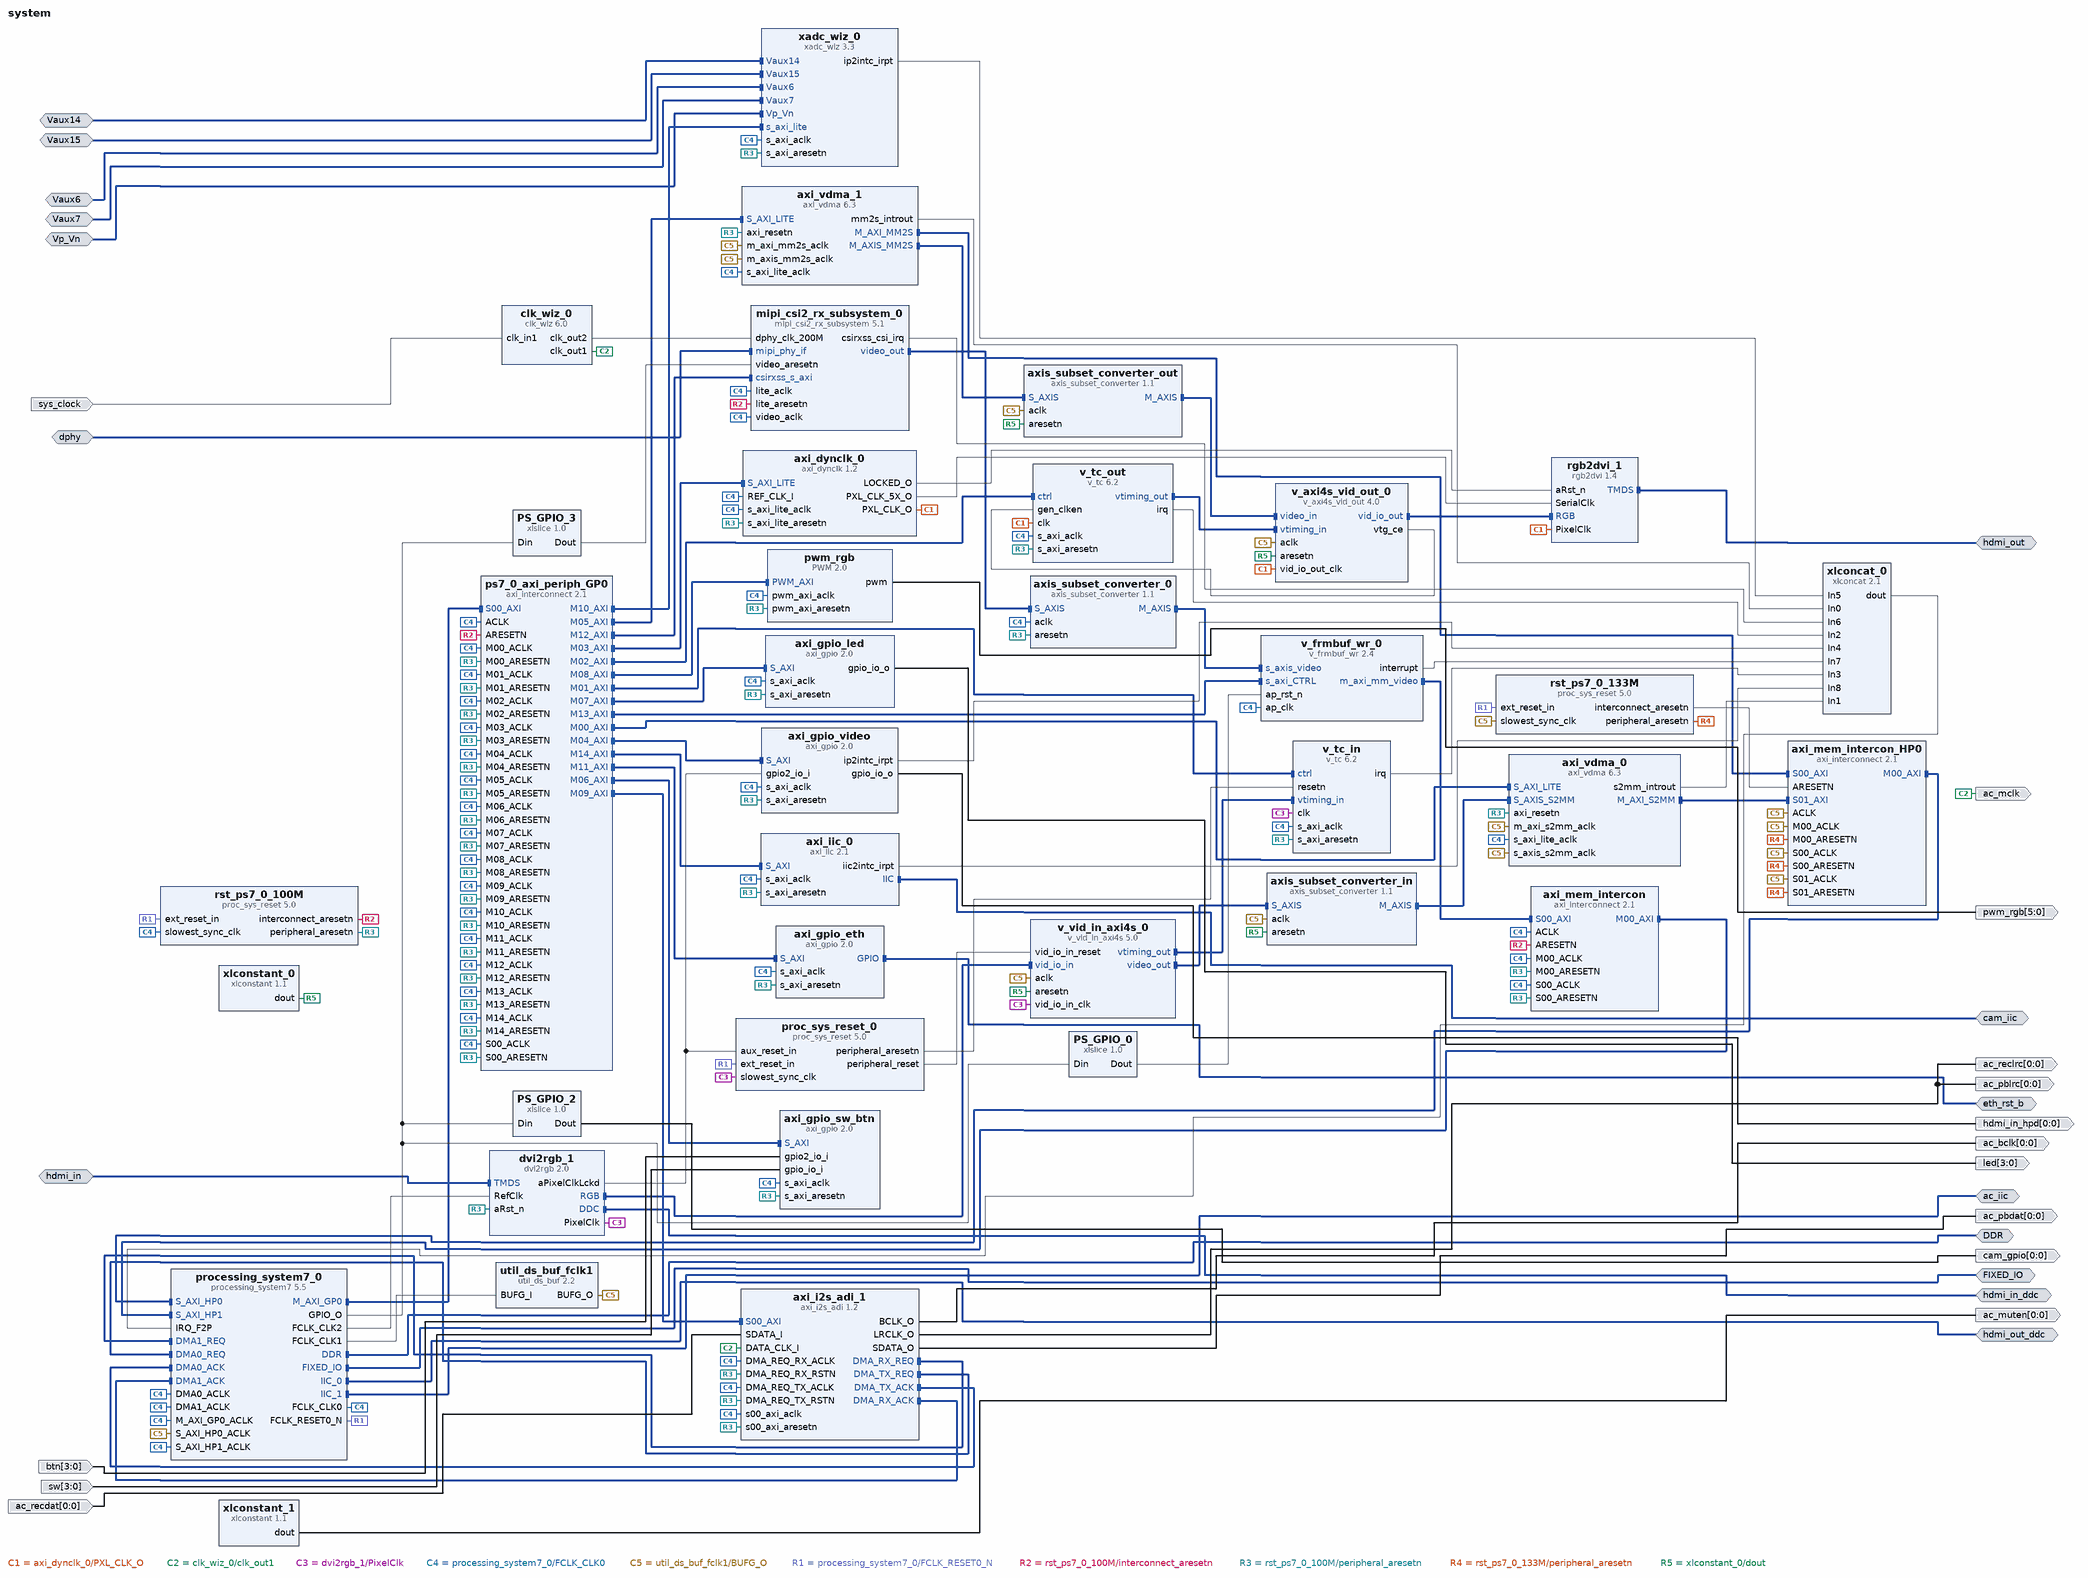
[diagram p0: block diagram of the top level]
# Vivado block design system, xc7z020clg400-1, Vivado 2022.1
create_bd_design system

create_bd_intf_port -mode Master -vlnv xilinx.com:interface:ddrx_rtl:1.0 DDR
create_bd_intf_port -mode Master -vlnv xilinx.com:display_processing_system7:fixedio_rtl:1.0 FIXED_IO
create_bd_intf_port -mode Slave -vlnv xilinx.com:interface:diff_analog_io_rtl:1.0 Vaux6
create_bd_intf_port -mode Slave -vlnv xilinx.com:interface:diff_analog_io_rtl:1.0 Vaux7
create_bd_intf_port -mode Slave -vlnv xilinx.com:interface:diff_analog_io_rtl:1.0 Vaux14
create_bd_intf_port -mode Slave -vlnv xilinx.com:interface:diff_analog_io_rtl:1.0 Vaux15
create_bd_intf_port -mode Slave -vlnv xilinx.com:interface:diff_analog_io_rtl:1.0 Vp_Vn
create_bd_intf_port -mode Master -vlnv xilinx.com:interface:iic_rtl:1.0 ac_iic
create_bd_intf_port -mode Master -vlnv xilinx.com:interface:iic_rtl:1.0 cam_iic
create_bd_intf_port -mode Slave -vlnv xilinx.com:interface:mipi_phy_rtl:1.0 dphy
create_bd_intf_port -mode Master -vlnv xilinx.com:interface:gpio_rtl:1.0 eth_rst_b
create_bd_intf_port -mode Slave -vlnv digilentinc.com:interface:tmds_rtl:1.0 hdmi_in
create_bd_intf_port -mode Master -vlnv xilinx.com:interface:iic_rtl:1.0 hdmi_in_ddc
create_bd_intf_port -mode Master -vlnv digilentinc.com:interface:tmds_rtl:1.0 hdmi_out
create_bd_intf_port -mode Master -vlnv xilinx.com:interface:iic_rtl:1.0 hdmi_out_ddc
create_bd_port -dir O -from 0 -to 0 ac_bclk
create_bd_port -dir O -type clk ac_mclk
create_bd_port -dir O -from 0 -to 0 ac_muten
create_bd_port -dir O -from 0 -to 0 ac_pbdat
create_bd_port -dir O -from 0 -to 0 ac_pblrc
create_bd_port -dir I -from 0 -to 0 ac_recdat
create_bd_port -dir O -from 0 -to 0 ac_reclrc
create_bd_port -dir O -from 0 -to 0 cam_gpio
create_bd_port -dir O -from 0 -to 0 hdmi_in_hpd
create_bd_port -dir O -from 5 -to 0 pwm_rgb
create_bd_port -dir I -type clk sys_clock
set_property -dict {CONFIG.FREQ_HZ 125000000 CONFIG.PHASE 0.000} [get_bd_ports sys_clock]
create_bd_port -dir I -from 3 -to 0 sw
create_bd_port -dir I -from 3 -to 0 btn
create_bd_port -dir O -from 3 -to 0 led

create_bd_cell -type ip -vlnv xilinx.com:ip:xlslice:1.0 PS_GPIO_0
set_property -dict {CONFIG.DIN_FROM 0 CONFIG.DIN_TO 0 CONFIG.DIN_WIDTH 64} [get_bd_cells PS_GPIO_0]
create_bd_cell -type ip -vlnv xilinx.com:ip:xlslice:1.0 PS_GPIO_2
set_property -dict {CONFIG.DIN_FROM 2 CONFIG.DIN_TO 2 CONFIG.DIN_WIDTH 64 CONFIG.DOUT_WIDTH 1} [get_bd_cells PS_GPIO_2]
create_bd_cell -type ip -vlnv xilinx.com:ip:xlslice:1.0 PS_GPIO_3
set_property -dict {CONFIG.DIN_FROM 3 CONFIG.DIN_TO 3 CONFIG.DIN_WIDTH 64 CONFIG.DOUT_WIDTH 1} [get_bd_cells PS_GPIO_3]
create_bd_cell -type ip -vlnv digilentinc.com:ip:axi_dynclk:1.2 axi_dynclk_0
create_bd_cell -type ip -vlnv xilinx.com:ip:axi_gpio:2.0 axi_gpio_eth
set_property -dict [list \
  CONFIG.C_DOUT_DEFAULT 0x00000000 \
  CONFIG.C_GPIO_WIDTH 1 \
  CONFIG.C_TRI_DEFAULT 0xFFFFFFFF \
] [get_bd_cells axi_gpio_eth]
create_bd_cell -type ip -vlnv xilinx.com:ip:axi_gpio:2.0 axi_gpio_led
set_property -dict [list \
  CONFIG.C_ALL_OUTPUTS 1 \
  CONFIG.C_DOUT_DEFAULT 0x00000000 \
  CONFIG.C_GPIO_WIDTH 4 \
  CONFIG.USE_BOARD_FLOW true \
] [get_bd_cells axi_gpio_led]
create_bd_cell -type ip -vlnv xilinx.com:ip:axi_gpio:2.0 axi_gpio_sw_btn
set_property -dict [list \
  CONFIG.C_ALL_INPUTS 1 \
  CONFIG.C_ALL_INPUTS_2 1 \
  CONFIG.C_GPIO2_WIDTH 4 \
  CONFIG.C_GPIO_WIDTH 4 \
  CONFIG.C_IS_DUAL 1 \
  CONFIG.USE_BOARD_FLOW true \
] [get_bd_cells axi_gpio_sw_btn]
create_bd_cell -type ip -vlnv xilinx.com:ip:axi_gpio:2.0 axi_gpio_video
set_property -dict [list \
  CONFIG.C_ALL_INPUTS_2 1 \
  CONFIG.C_ALL_OUTPUTS 1 \
  CONFIG.C_GPIO2_WIDTH 1 \
  CONFIG.C_GPIO_WIDTH 1 \
  CONFIG.C_INTERRUPT_PRESENT 1 \
  CONFIG.C_IS_DUAL 1 \
] [get_bd_cells axi_gpio_video]
create_bd_cell -type ip -vlnv digilentinc.com:user:axi_i2s_adi:1.2 axi_i2s_adi_1
set_property -dict {CONFIG.C_DMA_TYPE 1} [get_bd_cells axi_i2s_adi_1]
create_bd_cell -type ip -vlnv xilinx.com:ip:axi_iic:2.1 axi_iic_0
set_property -dict {CONFIG.IIC_FREQ_KHZ 400} [get_bd_cells axi_iic_0]
create_bd_cell -type ip -vlnv xilinx.com:ip:axi_interconnect:2.1 axi_mem_intercon
set_property -dict {CONFIG.NUM_MI 1 CONFIG.S00_HAS_DATA_FIFO 0 CONFIG.S00_HAS_REGSLICE 0} [get_bd_cells axi_mem_intercon]
create_bd_cell -type ip -vlnv xilinx.com:ip:axi_interconnect:2.1 axi_mem_intercon_HP0
set_property -dict [list \
  CONFIG.ENABLE_ADVANCED_OPTIONS 1 \
  CONFIG.M00_HAS_REGSLICE 4 \
  CONFIG.NUM_MI 1 \
  CONFIG.NUM_SI 2 \
  CONFIG.S00_HAS_REGSLICE 4 \
  CONFIG.S01_HAS_REGSLICE 4 \
  CONFIG.SYNCHRONIZATION_STAGES 2 \
  CONFIG.XBAR_DATA_WIDTH 64 \
] [get_bd_cells axi_mem_intercon_HP0]
create_bd_cell -type ip -vlnv xilinx.com:ip:axi_vdma:6.3 axi_vdma_0
set_property -dict [list \
  CONFIG.c_include_mm2s 0 \
  CONFIG.c_include_s2mm_dre 1 \
  CONFIG.c_m_axi_s2mm_data_width 64 \
  CONFIG.c_num_fstores 1 \
  CONFIG.c_s2mm_linebuffer_depth 2048 \
  CONFIG.c_s2mm_max_burst_length 32 \
] [get_bd_cells axi_vdma_0]
create_bd_cell -type ip -vlnv xilinx.com:ip:axi_vdma:6.3 axi_vdma_1
set_property -dict [list \
  CONFIG.c_include_mm2s_dre 1 \
  CONFIG.c_include_s2mm 0 \
  CONFIG.c_m_axis_mm2s_tdata_width 32 \
  CONFIG.c_mm2s_linebuffer_depth 2048 \
  CONFIG.c_mm2s_max_burst_length 32 \
  CONFIG.c_num_fstores 1 \
] [get_bd_cells axi_vdma_1]
create_bd_cell -type ip -vlnv xilinx.com:ip:axis_subset_converter:1.1 axis_subset_converter_0
create_bd_cell -type ip -vlnv xilinx.com:ip:axis_subset_converter:1.1 axis_subset_converter_in
set_property -dict [list \
  CONFIG.M_HAS_TLAST 1 \
  CONFIG.M_TDATA_NUM_BYTES 3 \
  CONFIG.M_TUSER_WIDTH 1 \
  CONFIG.S_HAS_TLAST 1 \
  CONFIG.S_TDATA_NUM_BYTES 3 \
  CONFIG.S_TUSER_WIDTH 1 \
  CONFIG.TDATA_REMAP {tdata[23:16],tdata[7:0],tdata[15:8]} \
  CONFIG.TLAST_REMAP {tlast[0]} \
  CONFIG.TUSER_REMAP {tuser[0:0]} \
] [get_bd_cells axis_subset_converter_in]
create_bd_cell -type ip -vlnv xilinx.com:ip:axis_subset_converter:1.1 axis_subset_converter_out
create_bd_cell -type ip -vlnv xilinx.com:ip:clk_wiz:6.0 clk_wiz_0
set_property -dict [list \
  CONFIG.CLKIN1_JITTER_PS 80.0 \
  CONFIG.CLKOUT1_DRIVES BUFG \
  CONFIG.CLKOUT1_JITTER 251.068 \
  CONFIG.CLKOUT1_PHASE_ERROR 222.305 \
  CONFIG.CLKOUT1_REQUESTED_OUT_FREQ 12.000 \
  CONFIG.CLKOUT2_DRIVES BUFG \
  CONFIG.CLKOUT2_JITTER 161.296 \
  CONFIG.CLKOUT2_PHASE_ERROR 222.305 \
  CONFIG.CLKOUT2_REQUESTED_OUT_FREQ 200 \
  CONFIG.CLKOUT2_USED true \
  CONFIG.CLKOUT3_DRIVES BUFG \
  CONFIG.CLKOUT4_DRIVES BUFG \
  CONFIG.CLKOUT5_DRIVES BUFG \
  CONFIG.CLKOUT6_DRIVES BUFG \
  CONFIG.CLKOUT7_DRIVES BUFG \
  CONFIG.CLK_IN1_BOARD_INTERFACE sys_clock \
  CONFIG.MMCM_CLKFBOUT_MULT_F 48 \
  CONFIG.MMCM_CLKIN1_PERIOD 8.000 \
  CONFIG.MMCM_CLKIN2_PERIOD 10.000 \
  CONFIG.MMCM_CLKOUT0_DIVIDE_F 100 \
  CONFIG.MMCM_CLKOUT1_DIVIDE 6 \
  CONFIG.MMCM_COMPENSATION ZHOLD \
  CONFIG.MMCM_DIVCLK_DIVIDE 5 \
  CONFIG.NUM_OUT_CLKS 2 \
  CONFIG.PLL_CLKIN_PERIOD 8.000 \
  CONFIG.PRIMITIVE PLL \
  CONFIG.USE_BOARD_FLOW true \
  CONFIG.USE_LOCKED false \
  CONFIG.USE_RESET false \
] [get_bd_cells clk_wiz_0]
create_bd_cell -type ip -vlnv digilentinc.com:ip:dvi2rgb:2.0 dvi2rgb_1
set_property -dict [list \
  CONFIG.IIC_BOARD_INTERFACE hdmi_in_ddc \
  CONFIG.TMDS_BOARD_INTERFACE hdmi_in \
  CONFIG.kAddBUFG true \
  CONFIG.kClkRange 2 \
  CONFIG.kDebug false \
  CONFIG.kEdidFileName dgl_720p_cea.data \
  CONFIG.kRstActiveHigh false \
] [get_bd_cells dvi2rgb_1]
create_bd_cell -type ip -vlnv xilinx.com:ip:mipi_csi2_rx_subsystem:5.1 mipi_csi2_rx_subsystem_0
set_property -dict [list \
  CONFIG.CMN_NUM_LANES 2 \
  CONFIG.CMN_PXL_FORMAT YUV422_8bit \
  CONFIG.CMN_VC All \
  CONFIG.CSI_BUF_DEPTH 4096 \
  CONFIG.C_CAL_MODE FIXED \
  CONFIG.C_DPHY_LANES 2 \
  CONFIG.C_EXDES_BOARD ZCU102 \
  CONFIG.C_HS_LINE_RATE 800 \
  CONFIG.C_HS_SETTLE_NS 147 \
  CONFIG.C_IDLY_TAP 2 \
  CONFIG.C_SHARE_IDLYCTRL true \
  CONFIG.DPY_EN_REG_IF true \
  CONFIG.DPY_LINE_RATE 800 \
] [get_bd_cells mipi_csi2_rx_subsystem_0]
create_bd_cell -type ip -vlnv xilinx.com:ip:proc_sys_reset:5.0 proc_sys_reset_0
create_bd_cell -type ip -vlnv xilinx.com:ip:processing_system7:5.5 processing_system7_0
set_property -dict [list \
  CONFIG.PCW_APU_PERIPHERAL_FREQMHZ 667 \
  CONFIG.PCW_ENET0_ENET0_IO {MIO 16 .. 27} \
  CONFIG.PCW_ENET0_GRP_MDIO_ENABLE 1 \
  CONFIG.PCW_ENET0_GRP_MDIO_IO {MIO 52 .. 53} \
  CONFIG.PCW_ENET0_PERIPHERAL_ENABLE 1 \
  CONFIG.PCW_ENET0_RESET_ENABLE 0 \
  CONFIG.PCW_ENET_RESET_ENABLE 1 \
  CONFIG.PCW_ENET_RESET_SELECT {Share reset pin} \
  CONFIG.PCW_EN_CLK1_PORT 1 \
  CONFIG.PCW_EN_CLK2_PORT 1 \
  CONFIG.PCW_FCLK1_PERIPHERAL_CLKSRC {ARM PLL} \
  CONFIG.PCW_FPGA0_PERIPHERAL_FREQMHZ 100 \
  CONFIG.PCW_FPGA1_PERIPHERAL_FREQMHZ 133 \
  CONFIG.PCW_FPGA2_PERIPHERAL_FREQMHZ 200 \
  CONFIG.PCW_FPGA_FCLK1_ENABLE 1 \
  CONFIG.PCW_FPGA_FCLK2_ENABLE 1 \
  CONFIG.PCW_GP0_EN_MODIFIABLE_TXN 0 \
  CONFIG.PCW_GP1_EN_MODIFIABLE_TXN 0 \
  CONFIG.PCW_GPIO_EMIO_GPIO_ENABLE 1 \
  CONFIG.PCW_GPIO_EMIO_GPIO_IO 64 \
  CONFIG.PCW_GPIO_MIO_GPIO_ENABLE 1 \
  CONFIG.PCW_GPIO_MIO_GPIO_IO MIO \
  CONFIG.PCW_I2C0_I2C0_IO EMIO \
  CONFIG.PCW_I2C0_PERIPHERAL_ENABLE 1 \
  CONFIG.PCW_I2C1_I2C1_IO EMIO \
  CONFIG.PCW_I2C1_PERIPHERAL_ENABLE 1 \
  CONFIG.PCW_I2C_PERIPHERAL_FREQMHZ 111.111115 \
  CONFIG.PCW_I2C_RESET_ENABLE 1 \
  CONFIG.PCW_I2C_RESET_SELECT {Share reset pin} \
  CONFIG.PCW_IRQ_F2P_INTR 1 \
  CONFIG.PCW_PERIPHERAL_BOARD_PRESET part0 \
  CONFIG.PCW_PRESET_BANK1_VOLTAGE {LVCMOS 1.8V} \
  CONFIG.PCW_QSPI_GRP_FBCLK_ENABLE 1 \
  CONFIG.PCW_QSPI_GRP_FBCLK_IO {MIO 8} \
  CONFIG.PCW_QSPI_GRP_SINGLE_SS_ENABLE 1 \
  CONFIG.PCW_QSPI_GRP_SINGLE_SS_IO {MIO 1 .. 6} \
  CONFIG.PCW_QSPI_PERIPHERAL_ENABLE 1 \
  CONFIG.PCW_QSPI_QSPI_IO {MIO 1 .. 6} \
  CONFIG.PCW_SD0_GRP_CD_ENABLE 1 \
  CONFIG.PCW_SD0_GRP_CD_IO {MIO 47} \
  CONFIG.PCW_SD0_GRP_WP_ENABLE 0 \
  CONFIG.PCW_SD0_PERIPHERAL_ENABLE 1 \
  CONFIG.PCW_SD0_SD0_IO {MIO 40 .. 45} \
  CONFIG.PCW_SDIO_PERIPHERAL_FREQMHZ 50 \
  CONFIG.PCW_SINGLE_QSPI_DATA_MODE x4 \
  CONFIG.PCW_TTC0_PERIPHERAL_ENABLE 1 \
  CONFIG.PCW_TTC0_TTC0_IO EMIO \
  CONFIG.PCW_UART1_PERIPHERAL_ENABLE 1 \
  CONFIG.PCW_UART1_UART1_IO {MIO 48 .. 49} \
  CONFIG.PCW_UART_PERIPHERAL_FREQMHZ 100 \
  CONFIG.PCW_UIPARAM_DDR_FREQ_MHZ 533.333333 \
  CONFIG.PCW_UIPARAM_DDR_MEMORY_TYPE {DDR 3 (Low Voltage)} \
  CONFIG.PCW_UIPARAM_DDR_PARTNO {MT41K256M16 RE-125} \
  CONFIG.PCW_USB0_PERIPHERAL_ENABLE 1 \
  CONFIG.PCW_USB0_RESET_ENABLE 1 \
  CONFIG.PCW_USB0_RESET_IO {MIO 46} \
  CONFIG.PCW_USB0_USB0_IO {MIO 28 .. 39} \
  CONFIG.PCW_USB_RESET_ENABLE 1 \
  CONFIG.PCW_USB_RESET_SELECT {Share reset pin} \
  CONFIG.PCW_USE_DMA0 1 \
  CONFIG.PCW_USE_DMA1 1 \
  CONFIG.PCW_USE_FABRIC_INTERRUPT 1 \
  CONFIG.PCW_USE_S_AXI_HP0 1 \
  CONFIG.PCW_USE_S_AXI_HP1 1 \
] [get_bd_cells processing_system7_0]
# 520 more settings of processing_system7_0 are not shown: defaults, MIO pin electricals, DDR timing, and values the tool derives
create_bd_cell -type ip -vlnv xilinx.com:ip:axi_interconnect:2.1 ps7_0_axi_periph_GP0
set_property -dict {CONFIG.NUM_MI 15 CONFIG.SYNCHRONIZATION_STAGES 2} [get_bd_cells ps7_0_axi_periph_GP0]
create_bd_cell -type ip -vlnv digilentinc.com:IP:PWM:2.0 pwm_rgb
set_property -dict {CONFIG.NUM_PWM 6} [get_bd_cells pwm_rgb]
create_bd_cell -type ip -vlnv digilentinc.com:ip:rgb2dvi:1.4 rgb2dvi_1
set_property -dict [list \
  CONFIG.TMDS_BOARD_INTERFACE hdmi_out \
  CONFIG.kGenerateSerialClk false \
  CONFIG.kRstActiveHigh false \
] [get_bd_cells rgb2dvi_1]
create_bd_cell -type ip -vlnv xilinx.com:ip:proc_sys_reset:5.0 rst_ps7_0_100M
create_bd_cell -type ip -vlnv xilinx.com:ip:proc_sys_reset:5.0 rst_ps7_0_133M
create_bd_cell -type ip -vlnv xilinx.com:ip:util_ds_buf:2.2 util_ds_buf_fclk1
set_property -dict {CONFIG.C_BUF_TYPE BUFG} [get_bd_cells util_ds_buf_fclk1]
create_bd_cell -type ip -vlnv xilinx.com:ip:v_axi4s_vid_out:4.0 v_axi4s_vid_out_0
set_property -dict {CONFIG.C_ADDR_WIDTH 12 CONFIG.C_HAS_ASYNC_CLK 1 CONFIG.C_VTG_MASTER_SLAVE 1} [get_bd_cells v_axi4s_vid_out_0]
create_bd_cell -type ip -vlnv xilinx.com:ip:v_frmbuf_wr:2.4 v_frmbuf_wr_0
set_property -dict [list \
  CONFIG.AXIMM_DATA_WIDTH 64 \
  CONFIG.C_M_AXI_MM_VIDEO_DATA_WIDTH 64 \
  CONFIG.HAS_RGB8 0 \
  CONFIG.HAS_UYVY8 1 \
  CONFIG.HAS_YUYV8 1 \
  CONFIG.HAS_Y_UV8 1 \
  CONFIG.MAX_NR_PLANES 2 \
  CONFIG.SAMPLES_PER_CLOCK 1 \
] [get_bd_cells v_frmbuf_wr_0]
create_bd_cell -type ip -vlnv xilinx.com:ip:v_tc:6.2 v_tc_in
set_property -dict [list \
  CONFIG.HAS_INTC_IF true \
  CONFIG.enable_generation false \
  CONFIG.horizontal_blank_detection false \
  CONFIG.vertical_blank_detection false \
] [get_bd_cells v_tc_in]
create_bd_cell -type ip -vlnv xilinx.com:ip:v_tc:6.2 v_tc_out
set_property -dict {CONFIG.enable_detection false} [get_bd_cells v_tc_out]
create_bd_cell -type ip -vlnv xilinx.com:ip:v_vid_in_axi4s:5.0 v_vid_in_axi4s_0
set_property -dict {CONFIG.C_ADDR_WIDTH 12 CONFIG.C_HAS_ASYNC_CLK 1} [get_bd_cells v_vid_in_axi4s_0]
create_bd_cell -type ip -vlnv xilinx.com:ip:xadc_wiz:3.3 xadc_wiz_0
set_property -dict [list \
  CONFIG.CHANNEL_AVERAGING 16 \
  CONFIG.CHANNEL_ENABLE_CALIBRATION true \
  CONFIG.CHANNEL_ENABLE_TEMPERATURE true \
  CONFIG.CHANNEL_ENABLE_VAUXP14_VAUXN14 true \
  CONFIG.CHANNEL_ENABLE_VAUXP15_VAUXN15 true \
  CONFIG.CHANNEL_ENABLE_VAUXP6_VAUXN6 true \
  CONFIG.CHANNEL_ENABLE_VAUXP7_VAUXN7 true \
  CONFIG.CHANNEL_ENABLE_VBRAM true \
  CONFIG.CHANNEL_ENABLE_VCCAUX true \
  CONFIG.CHANNEL_ENABLE_VCCDDRO true \
  CONFIG.CHANNEL_ENABLE_VCCINT true \
  CONFIG.CHANNEL_ENABLE_VCCPAUX true \
  CONFIG.CHANNEL_ENABLE_VCCPINT true \
  CONFIG.CHANNEL_ENABLE_VP_VN false \
  CONFIG.CHANNEL_ENABLE_VREFN true \
  CONFIG.CHANNEL_ENABLE_VREFP true \
  CONFIG.ENABLE_RESET false \
  CONFIG.ENABLE_VCCDDRO_ALARM false \
  CONFIG.ENABLE_VCCPAUX_ALARM false \
  CONFIG.ENABLE_VCCPINT_ALARM false \
  CONFIG.EXTERNAL_MUX_CHANNEL VP_VN \
  CONFIG.INTERFACE_SELECTION Enable_AXI \
  CONFIG.OT_ALARM false \
  CONFIG.SEQUENCER_MODE Continuous \
  CONFIG.SINGLE_CHANNEL_SELECTION TEMPERATURE \
  CONFIG.USER_TEMP_ALARM false \
  CONFIG.VCCAUX_ALARM false \
  CONFIG.VCCINT_ALARM false \
  CONFIG.XADC_STARUP_SELECTION channel_sequencer \
] [get_bd_cells xadc_wiz_0]
create_bd_cell -type ip -vlnv xilinx.com:ip:xlconcat:2.1 xlconcat_0
set_property -dict {CONFIG.NUM_PORTS 9} [get_bd_cells xlconcat_0]
create_bd_cell -type ip -vlnv xilinx.com:ip:xlconstant:1.1 xlconstant_0
create_bd_cell -type ip -vlnv xilinx.com:ip:xlconstant:1.1 xlconstant_1

# ---- connections ----

connect_bd_intf_net -intf_net Vaux14_1 [get_bd_intf_ports Vaux14] [get_bd_intf_pins xadc_wiz_0/Vaux14]
connect_bd_intf_net -intf_net Vaux15_1 [get_bd_intf_ports Vaux15] [get_bd_intf_pins xadc_wiz_0/Vaux15]
connect_bd_intf_net -intf_net Vaux6_1 [get_bd_intf_ports Vaux6] [get_bd_intf_pins xadc_wiz_0/Vaux6]
connect_bd_intf_net -intf_net Vaux7_1 [get_bd_intf_ports Vaux7] [get_bd_intf_pins xadc_wiz_0/Vaux7]
connect_bd_intf_net [get_bd_intf_ports Vp_Vn] [get_bd_intf_pins xadc_wiz_0/Vp_Vn]
connect_bd_intf_net [get_bd_intf_ports eth_rst_b] [get_bd_intf_pins axi_gpio_eth/GPIO]
connect_bd_intf_net [get_bd_intf_pins axi_i2s_adi_1/DMA_RX_REQ] [get_bd_intf_pins processing_system7_0/DMA1_REQ]
connect_bd_intf_net [get_bd_intf_pins axi_i2s_adi_1/DMA_TX_REQ] [get_bd_intf_pins processing_system7_0/DMA0_REQ]
connect_bd_intf_net [get_bd_intf_ports cam_iic] [get_bd_intf_pins axi_iic_0/IIC]
connect_bd_intf_net -intf_net axi_mem_intercon_M00_AXI [get_bd_intf_pins axi_mem_intercon_HP0/M00_AXI] [get_bd_intf_pins processing_system7_0/S_AXI_HP0]
connect_bd_intf_net [get_bd_intf_pins axi_mem_intercon/M00_AXI] [get_bd_intf_pins processing_system7_0/S_AXI_HP1]
connect_bd_intf_net [get_bd_intf_pins axi_mem_intercon_HP0/S01_AXI] [get_bd_intf_pins axi_vdma_0/M_AXI_S2MM]
connect_bd_intf_net [get_bd_intf_pins axi_vdma_1/M_AXIS_MM2S] [get_bd_intf_pins axis_subset_converter_out/S_AXIS]
connect_bd_intf_net [get_bd_intf_pins axi_mem_intercon_HP0/S00_AXI] [get_bd_intf_pins axi_vdma_1/M_AXI_MM2S]
connect_bd_intf_net [get_bd_intf_pins axis_subset_converter_0/M_AXIS] [get_bd_intf_pins v_frmbuf_wr_0/s_axis_video]
connect_bd_intf_net [get_bd_intf_pins axi_vdma_0/S_AXIS_S2MM] [get_bd_intf_pins axis_subset_converter_in/M_AXIS]
connect_bd_intf_net [get_bd_intf_pins axis_subset_converter_out/M_AXIS] [get_bd_intf_pins v_axi4s_vid_out_0/video_in]
connect_bd_intf_net [get_bd_intf_ports dphy] [get_bd_intf_pins mipi_csi2_rx_subsystem_0/mipi_phy_if]
connect_bd_intf_net [get_bd_intf_ports hdmi_in_ddc] [get_bd_intf_pins dvi2rgb_1/DDC]
connect_bd_intf_net [get_bd_intf_pins dvi2rgb_1/RGB] [get_bd_intf_pins v_vid_in_axi4s_0/vid_io_in]
connect_bd_intf_net [get_bd_intf_ports hdmi_in] [get_bd_intf_pins dvi2rgb_1/TMDS]
connect_bd_intf_net [get_bd_intf_pins axis_subset_converter_0/S_AXIS] [get_bd_intf_pins mipi_csi2_rx_subsystem_0/video_out]
connect_bd_intf_net [get_bd_intf_ports DDR] [get_bd_intf_pins processing_system7_0/DDR]
connect_bd_intf_net [get_bd_intf_pins axi_i2s_adi_1/DMA_TX_ACK] [get_bd_intf_pins processing_system7_0/DMA0_ACK]
connect_bd_intf_net [get_bd_intf_pins axi_i2s_adi_1/DMA_RX_ACK] [get_bd_intf_pins processing_system7_0/DMA1_ACK]
connect_bd_intf_net [get_bd_intf_ports FIXED_IO] [get_bd_intf_pins processing_system7_0/FIXED_IO]
connect_bd_intf_net [get_bd_intf_ports hdmi_out_ddc] [get_bd_intf_pins processing_system7_0/IIC_0]
connect_bd_intf_net [get_bd_intf_ports ac_iic] [get_bd_intf_pins processing_system7_0/IIC_1]
connect_bd_intf_net [get_bd_intf_pins processing_system7_0/M_AXI_GP0] [get_bd_intf_pins ps7_0_axi_periph_GP0/S00_AXI]
connect_bd_intf_net [get_bd_intf_pins axi_gpio_video/S_AXI] [get_bd_intf_pins ps7_0_axi_periph_GP0/M04_AXI]
connect_bd_intf_net [get_bd_intf_pins axi_vdma_1/S_AXI_LITE] [get_bd_intf_pins ps7_0_axi_periph_GP0/M05_AXI]
connect_bd_intf_net [get_bd_intf_pins axi_gpio_sw_btn/S_AXI] [get_bd_intf_pins ps7_0_axi_periph_GP0/M06_AXI]
connect_bd_intf_net [get_bd_intf_pins axi_gpio_led/S_AXI] [get_bd_intf_pins ps7_0_axi_periph_GP0/M07_AXI]
connect_bd_intf_net [get_bd_intf_pins ps7_0_axi_periph_GP0/M08_AXI] [get_bd_intf_pins pwm_rgb/PWM_AXI]
connect_bd_intf_net [get_bd_intf_pins axi_i2s_adi_1/S00_AXI] [get_bd_intf_pins ps7_0_axi_periph_GP0/M09_AXI]
connect_bd_intf_net [get_bd_intf_pins ps7_0_axi_periph_GP0/M10_AXI] [get_bd_intf_pins xadc_wiz_0/s_axi_lite]
connect_bd_intf_net [get_bd_intf_pins axi_gpio_eth/S_AXI] [get_bd_intf_pins ps7_0_axi_periph_GP0/M11_AXI]
connect_bd_intf_net [get_bd_intf_pins mipi_csi2_rx_subsystem_0/csirxss_s_axi] [get_bd_intf_pins ps7_0_axi_periph_GP0/M12_AXI]
connect_bd_intf_net [get_bd_intf_pins ps7_0_axi_periph_GP0/M13_AXI] [get_bd_intf_pins v_frmbuf_wr_0/s_axi_CTRL]
connect_bd_intf_net [get_bd_intf_pins axi_iic_0/S_AXI] [get_bd_intf_pins ps7_0_axi_periph_GP0/M14_AXI]
connect_bd_intf_net [get_bd_intf_pins axi_vdma_0/S_AXI_LITE] [get_bd_intf_pins ps7_0_axi_periph_GP0/M00_AXI]
connect_bd_intf_net [get_bd_intf_pins ps7_0_axi_periph_GP0/M01_AXI] [get_bd_intf_pins v_tc_in/ctrl]
connect_bd_intf_net [get_bd_intf_pins ps7_0_axi_periph_GP0/M02_AXI] [get_bd_intf_pins v_tc_out/ctrl]
connect_bd_intf_net [get_bd_intf_pins axi_dynclk_0/S_AXI_LITE] [get_bd_intf_pins ps7_0_axi_periph_GP0/M03_AXI]
connect_bd_intf_net [get_bd_intf_ports hdmi_out] [get_bd_intf_pins rgb2dvi_1/TMDS]
connect_bd_intf_net [get_bd_intf_pins rgb2dvi_1/RGB] [get_bd_intf_pins v_axi4s_vid_out_0/vid_io_out]
connect_bd_intf_net [get_bd_intf_pins axi_mem_intercon/S00_AXI] [get_bd_intf_pins v_frmbuf_wr_0/m_axi_mm_video]
connect_bd_intf_net -intf_net v_tc_1_vtiming_out [get_bd_intf_pins v_axi4s_vid_out_0/vtiming_in] [get_bd_intf_pins v_tc_out/vtiming_out]
connect_bd_intf_net [get_bd_intf_pins axis_subset_converter_in/S_AXIS] [get_bd_intf_pins v_vid_in_axi4s_0/video_out]
connect_bd_intf_net [get_bd_intf_pins v_tc_in/vtiming_in] [get_bd_intf_pins v_vid_in_axi4s_0/vtiming_out]
connect_bd_net [get_bd_pins PS_GPIO_0/Dout] [get_bd_pins v_frmbuf_wr_0/ap_rst_n]
connect_bd_net -net PWM_0_pwm [get_bd_pins pwm_rgb/pwm] [get_bd_ports pwm_rgb]
connect_bd_net -net SDATA_I_1 [get_bd_ports ac_recdat] [get_bd_pins axi_i2s_adi_1/SDATA_I]
connect_bd_net [get_bd_pins axi_dynclk_0/LOCKED_O] [get_bd_pins rgb2dvi_1/aRst_n]
connect_bd_net [get_bd_pins axi_dynclk_0/PXL_CLK_5X_O] [get_bd_pins rgb2dvi_1/SerialClk]
connect_bd_net [get_bd_pins axi_dynclk_0/PXL_CLK_O] \
  [get_bd_pins rgb2dvi_1/PixelClk] [get_bd_pins v_axi4s_vid_out_0/vid_io_out_clk] [get_bd_pins v_tc_out/clk]
connect_bd_net -net axi_gpio_0_gpio_io_o [get_bd_pins axi_gpio_video/gpio_io_o] [get_bd_ports hdmi_in_hpd]
connect_bd_net -net axi_gpio_0_ip2intc_irpt [get_bd_pins axi_gpio_video/ip2intc_irpt] [get_bd_pins xlconcat_0/In4]
connect_bd_net [get_bd_pins axi_gpio_led/gpio_io_o] [get_bd_ports led]
connect_bd_net [get_bd_pins axi_i2s_adi_1/BCLK_O] [get_bd_ports ac_bclk]
connect_bd_net [get_bd_pins axi_i2s_adi_1/LRCLK_O] [get_bd_ports ac_pblrc] [get_bd_ports ac_reclrc]
connect_bd_net [get_bd_pins axi_i2s_adi_1/SDATA_O] [get_bd_ports ac_pbdat]
connect_bd_net [get_bd_pins axi_iic_0/iic2intc_irpt] [get_bd_pins xlconcat_0/In8]
connect_bd_net [get_bd_pins axi_vdma_0/s2mm_introut] [get_bd_pins xlconcat_0/In1]
connect_bd_net [get_bd_pins axi_vdma_1/mm2s_introut] [get_bd_pins xlconcat_0/In0]
connect_bd_net [get_bd_ports btn] [get_bd_pins axi_gpio_sw_btn/gpio2_io_i]
connect_bd_net [get_bd_pins clk_wiz_0/clk_out1] [get_bd_ports ac_mclk] [get_bd_pins axi_i2s_adi_1/DATA_CLK_I]
connect_bd_net [get_bd_pins clk_wiz_0/clk_out2] [get_bd_pins mipi_csi2_rx_subsystem_0/dphy_clk_200M]
connect_bd_net -net csi2_rst_gpio [get_bd_pins PS_GPIO_3/Dout] [get_bd_pins mipi_csi2_rx_subsystem_0/video_aresetn]
connect_bd_net [get_bd_pins dvi2rgb_1/PixelClk] \
  [get_bd_pins proc_sys_reset_0/slowest_sync_clk] [get_bd_pins v_tc_in/clk] [get_bd_pins v_vid_in_axi4s_0/vid_io_in_clk]
connect_bd_net [get_bd_pins dvi2rgb_1/aPixelClkLckd] [get_bd_pins axi_gpio_video/gpio2_io_i] [get_bd_pins proc_sys_reset_0/aux_reset_in]
connect_bd_net [get_bd_pins mipi_csi2_rx_subsystem_0/csirxss_csi_irq] [get_bd_pins xlconcat_0/In6]
connect_bd_net [get_bd_pins proc_sys_reset_0/peripheral_aresetn] [get_bd_pins v_tc_in/resetn]
connect_bd_net [get_bd_pins proc_sys_reset_0/peripheral_reset] [get_bd_pins v_vid_in_axi4s_0/vid_io_in_reset]
connect_bd_net [get_bd_pins processing_system7_0/FCLK_CLK0] \
  [get_bd_pins axi_dynclk_0/REF_CLK_I] [get_bd_pins axi_dynclk_0/s_axi_lite_aclk] [get_bd_pins axi_gpio_eth/s_axi_aclk] \
  [get_bd_pins axi_gpio_led/s_axi_aclk] [get_bd_pins axi_gpio_sw_btn/s_axi_aclk] [get_bd_pins axi_gpio_video/s_axi_aclk] \
  [get_bd_pins axi_i2s_adi_1/DMA_REQ_RX_ACLK] [get_bd_pins axi_i2s_adi_1/DMA_REQ_TX_ACLK] \
  [get_bd_pins axi_i2s_adi_1/s00_axi_aclk] [get_bd_pins axi_iic_0/s_axi_aclk] [get_bd_pins axi_mem_intercon/ACLK] \
  [get_bd_pins axi_mem_intercon/M00_ACLK] [get_bd_pins axi_mem_intercon/S00_ACLK] [get_bd_pins axi_vdma_0/s_axi_lite_aclk] \
  [get_bd_pins axi_vdma_1/s_axi_lite_aclk] [get_bd_pins axis_subset_converter_0/aclk] \
  [get_bd_pins mipi_csi2_rx_subsystem_0/lite_aclk] [get_bd_pins mipi_csi2_rx_subsystem_0/video_aclk] \
  [get_bd_pins processing_system7_0/DMA0_ACLK] [get_bd_pins processing_system7_0/DMA1_ACLK] \
  [get_bd_pins processing_system7_0/M_AXI_GP0_ACLK] [get_bd_pins processing_system7_0/S_AXI_HP1_ACLK] \
  [get_bd_pins ps7_0_axi_periph_GP0/ACLK] [get_bd_pins ps7_0_axi_periph_GP0/M00_ACLK] \
  [get_bd_pins ps7_0_axi_periph_GP0/M01_ACLK] [get_bd_pins ps7_0_axi_periph_GP0/M02_ACLK] \
  [get_bd_pins ps7_0_axi_periph_GP0/M03_ACLK] [get_bd_pins ps7_0_axi_periph_GP0/M04_ACLK] \
  [get_bd_pins ps7_0_axi_periph_GP0/M05_ACLK] [get_bd_pins ps7_0_axi_periph_GP0/M06_ACLK] \
  [get_bd_pins ps7_0_axi_periph_GP0/M07_ACLK] [get_bd_pins ps7_0_axi_periph_GP0/M08_ACLK] \
  [get_bd_pins ps7_0_axi_periph_GP0/M09_ACLK] [get_bd_pins ps7_0_axi_periph_GP0/M10_ACLK] \
  [get_bd_pins ps7_0_axi_periph_GP0/M11_ACLK] [get_bd_pins ps7_0_axi_periph_GP0/M12_ACLK] \
  [get_bd_pins ps7_0_axi_periph_GP0/M13_ACLK] [get_bd_pins ps7_0_axi_periph_GP0/M14_ACLK] \
  [get_bd_pins ps7_0_axi_periph_GP0/S00_ACLK] [get_bd_pins pwm_rgb/pwm_axi_aclk] \
  [get_bd_pins rst_ps7_0_100M/slowest_sync_clk] [get_bd_pins v_frmbuf_wr_0/ap_clk] [get_bd_pins v_tc_in/s_axi_aclk] \
  [get_bd_pins v_tc_out/s_axi_aclk] [get_bd_pins xadc_wiz_0/s_axi_aclk]
connect_bd_net -net processing_system7_0_FCLK_CLK1 [get_bd_pins util_ds_buf_fclk1/BUFG_O] \
  [get_bd_pins axi_mem_intercon_HP0/ACLK] [get_bd_pins axi_mem_intercon_HP0/M00_ACLK] \
  [get_bd_pins axi_mem_intercon_HP0/S00_ACLK] [get_bd_pins axi_mem_intercon_HP0/S01_ACLK] \
  [get_bd_pins axi_vdma_0/m_axi_s2mm_aclk] [get_bd_pins axi_vdma_0/s_axis_s2mm_aclk] [get_bd_pins axi_vdma_1/m_axi_mm2s_aclk] \
  [get_bd_pins axi_vdma_1/m_axis_mm2s_aclk] [get_bd_pins axis_subset_converter_in/aclk] \
  [get_bd_pins axis_subset_converter_out/aclk] [get_bd_pins processing_system7_0/S_AXI_HP0_ACLK] \
  [get_bd_pins rst_ps7_0_133M/slowest_sync_clk] [get_bd_pins v_axi4s_vid_out_0/aclk] [get_bd_pins v_vid_in_axi4s_0/aclk]
connect_bd_net [get_bd_pins processing_system7_0/FCLK_CLK2] [get_bd_pins dvi2rgb_1/RefClk]
connect_bd_net [get_bd_pins processing_system7_0/FCLK_CLK1] [get_bd_pins util_ds_buf_fclk1/BUFG_I]
connect_bd_net [get_bd_pins processing_system7_0/FCLK_RESET0_N] \
  [get_bd_pins proc_sys_reset_0/ext_reset_in] [get_bd_pins rst_ps7_0_100M/ext_reset_in] \
  [get_bd_pins rst_ps7_0_133M/ext_reset_in]
connect_bd_net [get_bd_pins processing_system7_0/GPIO_O] [get_bd_pins PS_GPIO_0/Din] [get_bd_pins PS_GPIO_2/Din] [get_bd_pins PS_GPIO_3/Din]
connect_bd_net [get_bd_pins rst_ps7_0_100M/interconnect_aresetn] \
  [get_bd_pins axi_mem_intercon/ARESETN] [get_bd_pins mipi_csi2_rx_subsystem_0/lite_aresetn] \
  [get_bd_pins ps7_0_axi_periph_GP0/ARESETN]
connect_bd_net [get_bd_pins rst_ps7_0_100M/peripheral_aresetn] \
  [get_bd_pins axi_dynclk_0/s_axi_lite_aresetn] [get_bd_pins axi_gpio_eth/s_axi_aresetn] \
  [get_bd_pins axi_gpio_led/s_axi_aresetn] [get_bd_pins axi_gpio_sw_btn/s_axi_aresetn] \
  [get_bd_pins axi_gpio_video/s_axi_aresetn] [get_bd_pins axi_i2s_adi_1/DMA_REQ_RX_RSTN] \
  [get_bd_pins axi_i2s_adi_1/DMA_REQ_TX_RSTN] [get_bd_pins axi_i2s_adi_1/s00_axi_aresetn] \
  [get_bd_pins axi_iic_0/s_axi_aresetn] [get_bd_pins axi_mem_intercon/M00_ARESETN] [get_bd_pins axi_mem_intercon/S00_ARESETN] \
  [get_bd_pins axi_vdma_0/axi_resetn] [get_bd_pins axi_vdma_1/axi_resetn] [get_bd_pins axis_subset_converter_0/aresetn] \
  [get_bd_pins dvi2rgb_1/aRst_n] [get_bd_pins ps7_0_axi_periph_GP0/M00_ARESETN] \
  [get_bd_pins ps7_0_axi_periph_GP0/M01_ARESETN] [get_bd_pins ps7_0_axi_periph_GP0/M02_ARESETN] \
  [get_bd_pins ps7_0_axi_periph_GP0/M03_ARESETN] [get_bd_pins ps7_0_axi_periph_GP0/M04_ARESETN] \
  [get_bd_pins ps7_0_axi_periph_GP0/M05_ARESETN] [get_bd_pins ps7_0_axi_periph_GP0/M06_ARESETN] \
  [get_bd_pins ps7_0_axi_periph_GP0/M07_ARESETN] [get_bd_pins ps7_0_axi_periph_GP0/M08_ARESETN] \
  [get_bd_pins ps7_0_axi_periph_GP0/M09_ARESETN] [get_bd_pins ps7_0_axi_periph_GP0/M10_ARESETN] \
  [get_bd_pins ps7_0_axi_periph_GP0/M11_ARESETN] [get_bd_pins ps7_0_axi_periph_GP0/M12_ARESETN] \
  [get_bd_pins ps7_0_axi_periph_GP0/M13_ARESETN] [get_bd_pins ps7_0_axi_periph_GP0/M14_ARESETN] \
  [get_bd_pins ps7_0_axi_periph_GP0/S00_ARESETN] [get_bd_pins pwm_rgb/pwm_axi_aresetn] [get_bd_pins v_tc_in/s_axi_aresetn] \
  [get_bd_pins v_tc_out/s_axi_aresetn] [get_bd_pins xadc_wiz_0/s_axi_aresetn]
connect_bd_net [get_bd_pins rst_ps7_0_133M/interconnect_aresetn] [get_bd_pins axi_mem_intercon_HP0/ARESETN]
connect_bd_net [get_bd_pins rst_ps7_0_133M/peripheral_aresetn] \
  [get_bd_pins axi_mem_intercon_HP0/M00_ARESETN] [get_bd_pins axi_mem_intercon_HP0/S00_ARESETN] \
  [get_bd_pins axi_mem_intercon_HP0/S01_ARESETN]
connect_bd_net -net sensor_rst_gpio [get_bd_pins PS_GPIO_2/Dout] [get_bd_ports cam_gpio]
connect_bd_net [get_bd_ports sw] [get_bd_pins axi_gpio_sw_btn/gpio_io_i]
connect_bd_net [get_bd_ports sys_clock] [get_bd_pins clk_wiz_0/clk_in1]
connect_bd_net [get_bd_pins v_axi4s_vid_out_0/vtg_ce] [get_bd_pins v_tc_out/gen_clken]
connect_bd_net -net v_frmbuf_wr_1_interrupt [get_bd_pins v_frmbuf_wr_0/interrupt] [get_bd_pins xlconcat_0/In7]
connect_bd_net -net v_tc_1_irq [get_bd_pins v_tc_out/irq] [get_bd_pins xlconcat_0/In2]
connect_bd_net [get_bd_pins v_tc_in/irq] [get_bd_pins xlconcat_0/In3]
connect_bd_net [get_bd_pins xadc_wiz_0/ip2intc_irpt] [get_bd_pins xlconcat_0/In5]
connect_bd_net [get_bd_pins xlconcat_0/dout] [get_bd_pins processing_system7_0/IRQ_F2P]
connect_bd_net [get_bd_pins xlconstant_0/dout] \
  [get_bd_pins axis_subset_converter_in/aresetn] [get_bd_pins axis_subset_converter_out/aresetn] \
  [get_bd_pins v_axi4s_vid_out_0/aresetn] [get_bd_pins v_vid_in_axi4s_0/aresetn]
connect_bd_net [get_bd_pins xlconstant_1/dout] [get_bd_ports ac_muten]

# ---- address map ----
assign_bd_address -offset 0x00000000 -range 1G -target_address_space [get_bd_addr_spaces axi_vdma_0/Data_S2MM] [get_bd_addr_segs processing_system7_0/S_AXI_HP0/HP0_DDR_LOWOCM]
assign_bd_address -offset 0x00000000 -range 1G -target_address_space [get_bd_addr_spaces axi_vdma_1/Data_MM2S] [get_bd_addr_segs processing_system7_0/S_AXI_HP0/HP0_DDR_LOWOCM]
assign_bd_address -offset 0x41200000 -range 64K -target_address_space [get_bd_addr_spaces processing_system7_0/Data] [get_bd_addr_segs axi_gpio_video/S_AXI/Reg]
assign_bd_address -offset 0x41210000 -range 64K -target_address_space [get_bd_addr_spaces processing_system7_0/Data] [get_bd_addr_segs axi_gpio_sw_btn/S_AXI/Reg]
assign_bd_address -offset 0x41220000 -range 64K -target_address_space [get_bd_addr_spaces processing_system7_0/Data] [get_bd_addr_segs axi_gpio_led/S_AXI/Reg]
assign_bd_address -offset 0x41230000 -range 64K -target_address_space [get_bd_addr_spaces processing_system7_0/Data] [get_bd_addr_segs axi_gpio_eth/S_AXI/Reg]
assign_bd_address -offset 0x41600000 -range 64K -target_address_space [get_bd_addr_spaces processing_system7_0/Data] [get_bd_addr_segs axi_iic_0/S_AXI/Reg]
assign_bd_address -offset 0x43000000 -range 64K -target_address_space [get_bd_addr_spaces processing_system7_0/Data] [get_bd_addr_segs axi_vdma_0/S_AXI_LITE/Reg]
assign_bd_address -offset 0x43010000 -range 64K -target_address_space [get_bd_addr_spaces processing_system7_0/Data] [get_bd_addr_segs axi_vdma_1/S_AXI_LITE/Reg]
assign_bd_address -offset 0x43C00000 -range 64K -target_address_space [get_bd_addr_spaces processing_system7_0/Data] [get_bd_addr_segs v_tc_in/ctrl/Reg]
assign_bd_address -offset 0x43C10000 -range 64K -target_address_space [get_bd_addr_spaces processing_system7_0/Data] [get_bd_addr_segs v_tc_out/ctrl/Reg]
assign_bd_address -offset 0x43C20000 -range 64K -target_address_space [get_bd_addr_spaces processing_system7_0/Data] [get_bd_addr_segs axi_dynclk_0/S_AXI_LITE/S_AXI_LITE_reg]
assign_bd_address -offset 0x43C30000 -range 64K -target_address_space [get_bd_addr_spaces processing_system7_0/Data] [get_bd_addr_segs pwm_rgb/PWM_AXI/PWM_AXI_reg]
assign_bd_address -offset 0x43C40000 -range 64K -target_address_space [get_bd_addr_spaces processing_system7_0/Data] [get_bd_addr_segs axi_i2s_adi_1/S00_AXI/S00_AXI_reg]
assign_bd_address -offset 0x43C50000 -range 64K -target_address_space [get_bd_addr_spaces processing_system7_0/Data] [get_bd_addr_segs xadc_wiz_0/s_axi_lite/Reg]
assign_bd_address -offset 0x43C60000 -range 128K -target_address_space [get_bd_addr_spaces processing_system7_0/Data] [get_bd_addr_segs mipi_csi2_rx_subsystem_0/csirxss_s_axi/Reg]
assign_bd_address -offset 0x43C80000 -range 64K -target_address_space [get_bd_addr_spaces processing_system7_0/Data] [get_bd_addr_segs v_frmbuf_wr_0/s_axi_CTRL/Reg]
assign_bd_address -offset 0x00000000 -range 1G -target_address_space [get_bd_addr_spaces v_frmbuf_wr_0/Data_m_axi_mm_video] [get_bd_addr_segs processing_system7_0/S_AXI_HP1/HP1_DDR_LOWOCM]

validate_bd_design
save_bd_design
